# EAGLE schematic AutoSpielSimplified (EAGLE 9.2.0)
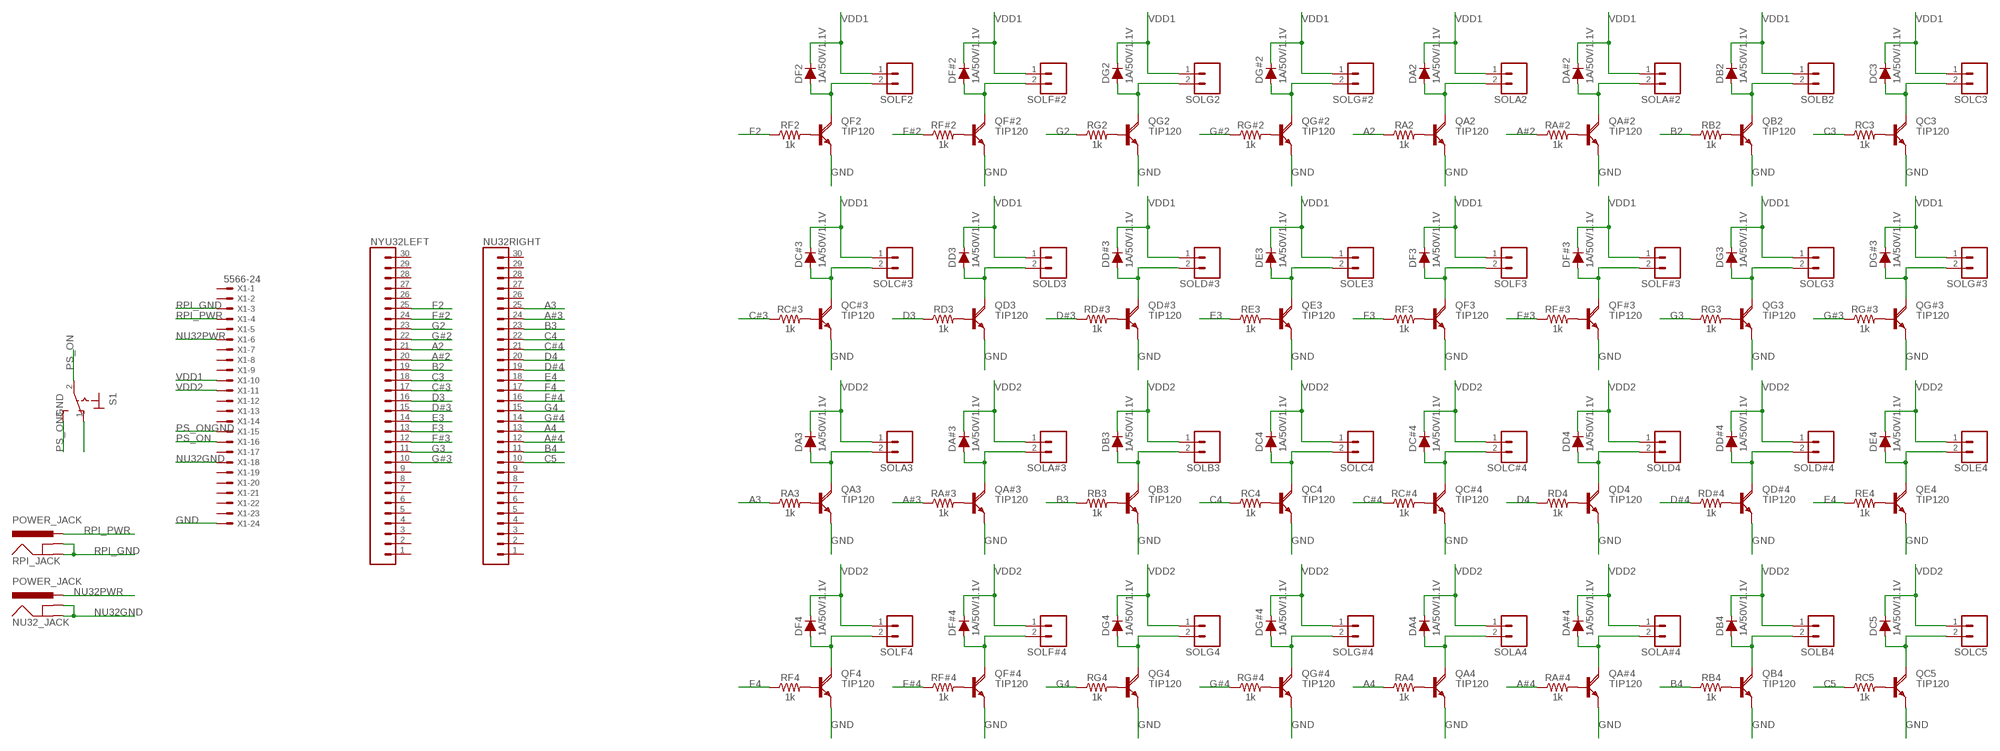
[diagram p0: schematic, sheet 1]

## Parts
DA2  1A/50V/1.1V  DIODE-PTH  [DIODE-1N4001]
DA3  1A/50V/1.1V  DIODE-PTH  [DIODE-1N4001]
DA4  1A/50V/1.1V  DIODE-PTH  [DIODE-1N4001]
DA#2  1A/50V/1.1V  DIODE-PTH  [DIODE-1N4001]
DA#3  1A/50V/1.1V  DIODE-PTH  [DIODE-1N4001]
DA#4  1A/50V/1.1V  DIODE-PTH  [DIODE-1N4001]
DB2  1A/50V/1.1V  DIODE-PTH  [DIODE-1N4001]
DB3  1A/50V/1.1V  DIODE-PTH  [DIODE-1N4001]
DB4  1A/50V/1.1V  DIODE-PTH  [DIODE-1N4001]
DC3  1A/50V/1.1V  DIODE-PTH  [DIODE-1N4001]
DC4  1A/50V/1.1V  DIODE-PTH  [DIODE-1N4001]
DC5  1A/50V/1.1V  DIODE-PTH  [DIODE-1N4001]
DC#3  1A/50V/1.1V  DIODE-PTH  [DIODE-1N4001]
DC#4  1A/50V/1.1V  DIODE-PTH  [DIODE-1N4001]
DD3  1A/50V/1.1V  DIODE-PTH  [DIODE-1N4001]
DD4  1A/50V/1.1V  DIODE-PTH  [DIODE-1N4001]
DD#3  1A/50V/1.1V  DIODE-PTH  [DIODE-1N4001]
DD#4  1A/50V/1.1V  DIODE-PTH  [DIODE-1N4001]
DE3  1A/50V/1.1V  DIODE-PTH  [DIODE-1N4001]
DE4  1A/50V/1.1V  DIODE-PTH  [DIODE-1N4001]
DF2  1A/50V/1.1V  DIODE-PTH  [DIODE-1N4001]
DF3  1A/50V/1.1V  DIODE-PTH  [DIODE-1N4001]
DF4  1A/50V/1.1V  DIODE-PTH  [DIODE-1N4001]
DF#2  1A/50V/1.1V  DIODE-PTH  [DIODE-1N4001]
DF#3  1A/50V/1.1V  DIODE-PTH  [DIODE-1N4001]
DF#4  1A/50V/1.1V  DIODE-PTH  [DIODE-1N4001]
DG2  1A/50V/1.1V  DIODE-PTH  [DIODE-1N4001]
DG3  1A/50V/1.1V  DIODE-PTH  [DIODE-1N4001]
DG4  1A/50V/1.1V  DIODE-PTH  [DIODE-1N4001]
DG#2  1A/50V/1.1V  DIODE-PTH  [DIODE-1N4001]
DG#3  1A/50V/1.1V  DIODE-PTH  [DIODE-1N4001]
DG#4  1A/50V/1.1V  DIODE-PTH  [DIODE-1N4001]
NU32_JACK  POWER_JACK  [POWER_JACK_PTH]
NU32RIGHT  CONN_30  [1X30]
NYU32LEFT  CONN_30  [1X30]
QA2  TIP120  [TO220AH]
QA3  TIP120  [TO220AH]
QA4  TIP120  [TO220AH]
QA#2  TIP120  [TO220AH]
QA#3  TIP120  [TO220AH]
QA#4  TIP120  [TO220AH]
QB2  TIP120  [TO220AH]
QB3  TIP120  [TO220AH]
QB4  TIP120  [TO220AH]
QC3  TIP120  [TO220AH]
QC4  TIP120  [TO220AH]
QC5  TIP120  [TO220AH]
QC#3  TIP120  [TO220AH]
QC#4  TIP120  [TO220AH]
QD3  TIP120  [TO220AH]
QD4  TIP120  [TO220AH]
QD#3  TIP120  [TO220AH]
QD#4  TIP120  [TO220AH]
QE3  TIP120  [TO220AH]
QE4  TIP120  [TO220AH]
QF2  TIP120  [TO220AH]
QF3  TIP120  [TO220AH]
QF4  TIP120  [TO220AH]
QF#2  TIP120  [TO220AH]
QF#3  TIP120  [TO220AH]
QF#4  TIP120  [TO220AH]
QG2  TIP120  [TO220AH]
QG3  TIP120  [TO220AH]
QG4  TIP120  [TO220AH]
QG#2  TIP120  [TO220AH]
QG#3  TIP120  [TO220AH]
QG#4  TIP120  [TO220AH]
RA2  1k  1KOHM-HORIZ-1/4W-5%  [AXIAL-0.3]
RA3  1k  1KOHM-HORIZ-1/4W-5%  [AXIAL-0.3]
RA4  1k  1KOHM-HORIZ-1/4W-5%  [AXIAL-0.3]
RA#2  1k  1KOHM-HORIZ-1/4W-5%  [AXIAL-0.3]
RA#3  1k  1KOHM-HORIZ-1/4W-5%  [AXIAL-0.3]
RA#4  1k  1KOHM-HORIZ-1/4W-5%  [AXIAL-0.3]
RB2  1k  1KOHM-HORIZ-1/4W-5%  [AXIAL-0.3]
RB3  1k  1KOHM-HORIZ-1/4W-5%  [AXIAL-0.3]
RB4  1k  1KOHM-HORIZ-1/4W-5%  [AXIAL-0.3]
RC3  1k  1KOHM-HORIZ-1/4W-5%  [AXIAL-0.3]
RC4  1k  1KOHM-HORIZ-1/4W-5%  [AXIAL-0.3]
RC5  1k  1KOHM-HORIZ-1/4W-5%  [AXIAL-0.3]
RC#3  1k  1KOHM-HORIZ-1/4W-5%  [AXIAL-0.3]
RC#4  1k  1KOHM-HORIZ-1/4W-5%  [AXIAL-0.3]
RD3  1k  1KOHM-HORIZ-1/4W-5%  [AXIAL-0.3]
RD4  1k  1KOHM-HORIZ-1/4W-5%  [AXIAL-0.3]
RD#3  1k  1KOHM-HORIZ-1/4W-5%  [AXIAL-0.3]
RD#4  1k  1KOHM-HORIZ-1/4W-5%  [AXIAL-0.3]
RE3  1k  1KOHM-HORIZ-1/4W-5%  [AXIAL-0.3]
RE4  1k  1KOHM-HORIZ-1/4W-5%  [AXIAL-0.3]
RF2  1k  1KOHM-HORIZ-1/4W-5%  [AXIAL-0.3]
RF3  1k  1KOHM-HORIZ-1/4W-5%  [AXIAL-0.3]
RF4  1k  1KOHM-HORIZ-1/4W-5%  [AXIAL-0.3]
RF#2  1k  1KOHM-HORIZ-1/4W-5%  [AXIAL-0.3]
RF#3  1k  1KOHM-HORIZ-1/4W-5%  [AXIAL-0.3]
RF#4  1k  1KOHM-HORIZ-1/4W-5%  [AXIAL-0.3]
RG2  1k  1KOHM-HORIZ-1/4W-5%  [AXIAL-0.3]
RG3  1k  1KOHM-HORIZ-1/4W-5%  [AXIAL-0.3]
RG4  1k  1KOHM-HORIZ-1/4W-5%  [AXIAL-0.3]
RG#2  1k  1KOHM-HORIZ-1/4W-5%  [AXIAL-0.3]
RG#3  1k  1KOHM-HORIZ-1/4W-5%  [AXIAL-0.3]
RG#4  1k  1KOHM-HORIZ-1/4W-5%  [AXIAL-0.3]
RPI_JACK  POWER_JACK  [POWER_JACK_PTH]
S1  M9040P  [M9040P]
SOLA2  CONN_02PTH4  [1X02_XTRA_BIG]
SOLA3  CONN_02PTH4  [1X02_XTRA_BIG]
SOLA4  CONN_02PTH4  [1X02_XTRA_BIG]
SOLA#2  CONN_02PTH4  [1X02_XTRA_BIG]
SOLA#3  CONN_02PTH4  [1X02_XTRA_BIG]
SOLA#4  CONN_02PTH4  [1X02_XTRA_BIG]
SOLB2  CONN_02PTH4  [1X02_XTRA_BIG]
SOLB3  CONN_02PTH4  [1X02_XTRA_BIG]
SOLB4  CONN_02PTH4  [1X02_XTRA_BIG]
SOLC3  CONN_02PTH4  [1X02_XTRA_BIG]
SOLC4  CONN_02PTH4  [1X02_XTRA_BIG]
SOLC5  CONN_02PTH4  [1X02_XTRA_BIG]
SOLC#3  CONN_02PTH4  [1X02_XTRA_BIG]
SOLC#4  CONN_02PTH4  [1X02_XTRA_BIG]
SOLD3  CONN_02PTH4  [1X02_XTRA_BIG]
SOLD4  CONN_02PTH4  [1X02_XTRA_BIG]
SOLD#3  CONN_02PTH4  [1X02_XTRA_BIG]
SOLD#4  CONN_02PTH4  [1X02_XTRA_BIG]
SOLE3  CONN_02PTH4  [1X02_XTRA_BIG]
SOLE4  CONN_02PTH4  [1X02_XTRA_BIG]
SOLF2  CONN_02PTH4  [1X02_XTRA_BIG]
SOLF3  CONN_02PTH4  [1X02_XTRA_BIG]
SOLF4  CONN_02PTH4  [1X02_XTRA_BIG]
SOLF#2  CONN_02PTH4  [1X02_XTRA_BIG]
SOLF#3  CONN_02PTH4  [1X02_XTRA_BIG]
SOLF#4  CONN_02PTH4  [1X02_XTRA_BIG]
SOLG2  CONN_02PTH4  [1X02_XTRA_BIG]
SOLG3  CONN_02PTH4  [1X02_XTRA_BIG]
SOLG4  CONN_02PTH4  [1X02_XTRA_BIG]
SOLG#2  CONN_02PTH4  [1X02_XTRA_BIG]
SOLG#3  CONN_02PTH4  [1X02_XTRA_BIG]
SOLG#4  CONN_02PTH4  [1X02_XTRA_BIG]
X1  5566-24  [5566-24]

## Nets
A2: NYU32LEFT.21 RA2.P$1
A3: NU32RIGHT.25 RA3.P$1
A4: NU32RIGHT.13 RA4.P$1
A#2: NYU32LEFT.20 RA#2.P$1
A#3: NU32RIGHT.24 RA#3.P$1
A#4: NU32RIGHT.12 RA#4.P$1
B2: NYU32LEFT.19 RB2.P$1
B3: NU32RIGHT.23 RB3.P$1
B4: NU32RIGHT.11 RB4.P$1
C3: NYU32LEFT.18 RC3.P$1
C4: NU32RIGHT.22 RC4.P$1
C5: NU32RIGHT.10 RC5.P$1
C#3: NYU32LEFT.17 RC#3.P$1
C#4: NU32RIGHT.21 RC#4.P$1
D3: NYU32LEFT.16 RD3.P$1
D4: NU32RIGHT.20 RD4.P$1
D#3: NYU32LEFT.15 RD#3.P$1
D#4: NU32RIGHT.19 RD#4.P$1
E3: NYU32LEFT.14 RE3.P$1
E4: NU32RIGHT.18 RE4.P$1
F2: NYU32LEFT.25 RF2.P$1
F3: NYU32LEFT.13 RF3.P$1
F4: NU32RIGHT.17 RF4.P$1
F#2: NYU32LEFT.24 RF#2.P$1
F#3: NYU32LEFT.12 RF#3.P$1
F#4: NU32RIGHT.16 RF#4.P$1
G2: NYU32LEFT.23 RG2.P$1
G3: NYU32LEFT.11 RG3.P$1
G4: NU32RIGHT.15 RG4.P$1
G#2: NYU32LEFT.22 RG#2.P$1
G#3: NYU32LEFT.10 RG#3.P$1
G#4: NU32RIGHT.14 RG#4.P$1
GND: QA2.E QA3.E QA4.E QA#2.E QA#3.E QA#4.E QB2.E QB3.E QB4.E QC3.E QC4.E QC5.E QC#3.E QC#4.E QD3.E QD4.E QD#3.E QD#4.E QE3.E QE4.E QF2.E QF3.E QF4.E QF#2.E QF#3.E QF#4.E QG2.E QG3.E QG4.E QG#2.E QG#3.E QG#4.E X1.24
N$1: QF2.B RF2.P$2
N$2: QC#3.B RC#3.P$2
N$3: DF2.A QF2.C SOLF2.2
N$4: QF#2.B RF#2.P$2
N$5: DF#2.A QF#2.C SOLF#2.2
N$6: DC#3.A QC#3.C SOLC#3.2
N$7: QG2.B RG2.P$2
N$8: DG2.A QG2.C SOLG2.2
N$9: QD3.B RD3.P$2
N$10: QG#2.B RG#2.P$2
N$11: DG#2.A QG#2.C SOLG#2.2
N$12: DD3.A QD3.C SOLD3.2
N$13: QA2.B RA2.P$2
N$14: DA2.A QA2.C SOLA2.2
N$15: QD#3.B RD#3.P$2
N$16: QA#2.B RA#2.P$2
N$17: DA#2.A QA#2.C SOLA#2.2
N$18: DD#3.A QD#3.C SOLD#3.2
N$19: QB2.B RB2.P$2
N$20: DB2.A QB2.C SOLB2.2
N$21: QE3.B RE3.P$2
N$22: QC3.B RC3.P$2
N$23: DC3.A QC3.C SOLC3.2
N$24: DE3.A QE3.C SOLE3.2
N$25: QA3.B RA3.P$2
N$26: DA3.A QA3.C SOLA3.2
N$27: QF3.B RF3.P$2
N$28: DF3.A QF3.C SOLF3.2
N$29: QF#3.B RF#3.P$2
N$30: DF#3.A QF#3.C SOLF#3.2
N$31: QG3.B RG3.P$2
N$32: DG3.A QG3.C SOLG3.2
N$33: QG#3.B RG#3.P$2
N$34: DG#3.A QG#3.C SOLG#3.2
N$35: QF4.B RF4.P$2
N$36: DF4.A QF4.C SOLF4.2
N$37: QF#4.B RF#4.P$2
N$38: DF#4.A QF#4.C SOLF#4.2
N$39: QG4.B RG4.P$2
N$40: DG4.A QG4.C SOLG4.2
N$41: QG#4.B RG#4.P$2
N$42: DG#4.A QG#4.C SOLG#4.2
N$43: QA4.B RA4.P$2
N$44: DA4.A QA4.C SOLA4.2
N$45: QA#4.B RA#4.P$2
N$46: DA#4.A QA#4.C SOLA#4.2
N$47: QB4.B RB4.P$2
N$48: DB4.A QB4.C SOLB4.2
N$49: QC5.B RC5.P$2
N$50: DC5.A QC5.C SOLC5.2
N$52: QA#3.B RA#3.P$2
N$53: DA#3.A QA#3.C SOLA#3.2
N$55: QB3.B RB3.P$2
N$56: DB3.A QB3.C SOLB3.2
N$57: S1.1(O)
N$58: QC4.B RC4.P$2
N$59: DC4.A QC4.C SOLC4.2
N$61: QC#4.B RC#4.P$2
N$62: DC#4.A QC#4.C SOLC#4.2
N$64: QD4.B RD4.P$2
N$65: DD4.A QD4.C SOLD4.2
N$67: QD#4.B RD#4.P$2
N$68: DD#4.A QD#4.C SOLD#4.2
N$70: QE4.B RE4.P$2
N$71: DE4.A QE4.C SOLE4.2
NU32GND: NU32_JACK.GND NU32_JACK.GNDBREAK X1.18
NU32PWR: NU32_JACK.PWR X1.6
PS_ON: S1.2(P) X1.16
PS_ONGND: S1.3(S) X1.15
RPI_GND: RPI_JACK.GND RPI_JACK.GNDBREAK X1.3
RPI_PWR: RPI_JACK.PWR X1.4
VDD1: DA2.C DA#2.C DB2.C DC3.C DC#3.C DD3.C DD#3.C DE3.C DF2.C DF3.C DF#2.C DF#3.C DG2.C DG3.C DG#2.C DG#3.C SOLA2.1 SOLA#2.1 SOLB2.1 SOLC3.1 SOLC#3.1 SOLD3.1 SOLD#3.1 SOLE3.1 SOLF2.1 SOLF3.1 SOLF#2.1 SOLF#3.1 SOLG2.1 SOLG3.1 SOLG#2.1 SOLG#3.1 X1.10
VDD2: DA3.C DA4.C DA#3.C DA#4.C DB3.C DB4.C DC4.C DC5.C DC#4.C DD4.C DD#4.C DE4.C DF4.C DF#4.C DG4.C DG#4.C SOLA3.1 SOLA4.1 SOLA#3.1 SOLA#4.1 SOLB3.1 SOLB4.1 SOLC4.1 SOLC5.1 SOLC#4.1 SOLD4.1 SOLD#4.1 SOLE4.1 SOLF4.1 SOLF#4.1 SOLG4.1 SOLG#4.1 X1.11
Unconnected: NU32RIGHT.1 NU32RIGHT.2 NU32RIGHT.3 NU32RIGHT.4 NU32RIGHT.5 NU32RIGHT.6 NU32RIGHT.7 NU32RIGHT.8 NU32RIGHT.9 NU32RIGHT.26 NU32RIGHT.27 NU32RIGHT.28 NU32RIGHT.29 NU32RIGHT.30 NYU32LEFT.1 NYU32LEFT.2 NYU32LEFT.3 NYU32LEFT.4 NYU32LEFT.5 NYU32LEFT.6 NYU32LEFT.7 NYU32LEFT.8 NYU32LEFT.9 NYU32LEFT.26 NYU32LEFT.27 NYU32LEFT.28 NYU32LEFT.29 NYU32LEFT.30 X1.1 X1.2 X1.5 X1.7 X1.8 X1.9 X1.12 X1.13 X1.14 X1.17 X1.19 X1.20 X1.21 X1.22 X1.23

## Library data of the parts
DA2-DA4 DA#2-DA#4 DB2-DB4 DC3-DC5 DC#3 DC#4 DD3 DD4 DD#3 DD#4 DE3 DE4 DF2-DF4 DF#2-DF#4 DG2-DG4 DG#2-DG#4 = SparkFun-DiscreteSemi:DIODE: Diode These are standard reverse protection diodes and small signal diodes. SparkFun Products: SparkFun SparkPunk Sound Kit <https://www.sparkfun.com/products/11177> SparkFun ESP8266 Thing <https://www.sparkfun.com/products/13231>; PROD_ID: DIO-09176
NU32_JACK RPI_JACK = SparkFun-Connectors:POWER_JACK: Power Jack Connector This is the standard 5.5mm barrel jack for power. The PTH is the most common, proven, reliable, footprint. The Slot footprint only works if the mill layer is transmitted to the PCB fab house so be warned. Here are the connectors we sell at SparkFun: DC Barrel Power Jack/Connector <https://www.sparkfun.com/products/119> (PRT-00119) DC Barrel Power Jack/Connector (SMD) <https://www.sparkfun.com/products/12748> (PRT-12748) DC Barrel Jack Adapter - Breadboard Compatible <https://www.sparkfun.com/products/10811> (PRT-10811) It is used on this SparkFun product (and many, many others): SparkFun RedBoard - Programmed with Arduino <https://www.sparkfun.com/products/12757> (DEV-12757) Also, if you need a mating power supply or connector, please check these out: Wall Adapter Power Supply - 9VDC 650mA <https://www.sparkfun.com/products/298> (TOL-00298) DC Barrel Jack Adapter - Male <https://www.sparkfun.com/products/10287> (PRT-10287); PROD_ID: CONN-08197
NU32RIGHT NYU32LEFT = SparkFun-Connectors:CONN_30: Multi connection point. Often used as Generic Header-pin footprint for 0.1 inch spaced/style header connections On any of the 0.1 inch spaced packages, you can populate with these: Break Away Headers - Straight <https://www.sparkfun.com/products/116> (PRT-00116) Break Away Male Headers - Right Angle <https://www.sparkfun.com/products/553> (PRT-00553) Female Headers <https://www.sparkfun.com/products/115> (PRT-00115) Break Away Headers - Machine Pin <https://www.sparkfun.com/products/117> (PRT-00117) Break Away Female Headers - Swiss Machine Pin <https://www.sparkfun.com/products/743> (PRT-00743) For SCREWTERMINALS and SPRING TERMINALS visit here: Screw Terimnals on SparkFun.com <https://www.sparkfun.com/search/results?term=Screw+Terminals> (5mm/3.5mm/2.54mm spacing) This device is also useful as a general connection point to wire up your design to another part of your project. Our various solder wires solder well into these plated through hole pads. Hook-Up Wire - Assortment (Stranded, 22 AWG) <https://www.sparkfun.com/products/11375> (PRT-11375) Hook-Up Wire - Assortment (Solid Core, 22 AWG) <https://www.sparkfun.com/products/11367> (PRT-11367) View the entire wire category on our website here <https://www.sparkfun.com/categories/141> Special notes: Molex polarized connector foot print use with SKU : PRT-08231 with associated crimp pins and housings. 1MM SMD Version SKU: PRT-10208 NOTES ON THE VARIANTS LOCK and LOCK_LONGPADS... This footprint was designed to help hold the alignment of a through-hole component (i.e. 6-pin header) while soldering it into place. You may notice that each hole has been shifted either up or down by 0.005 of an inch from it's more standard position (which is a perfectly straight line). This slight alteration caused the pins (the squares in the middle) to touch the edges of the holes. Because they are alternating, it causes a "brace" to hold the component in place. 0.005 has proven to be the perfect amount of "off-center" position when using our standard breakaway headers. Although looks a little odd when you look at the bare footprint, once you have a header in there, the alteration is very hard to notice. Also,if you push a header all the way into place, it is covered up entirely on the bottom side.
QA2-QA4 QA#2-QA#4 QB2-QB4 QC3-QC5 QC#3 QC#4 QD3 QD4 QD#3 QD#4 QE3 QE4 QF2-QF4 QF#2-QF#4 QG2-QG4 QG#2-QG#4 = transistor-power:TIP120: NPN DARLINGTON TRANSISTOR
RA2-RA4 RA#2-RA#4 RB2-RB4 RC3-RC5 RC#3 RC#4 RD3 RD4 RD#3 RD#4 RE3 RE4 RF2-RF4 RF#2-RF#4 RG2-RG4 RG#2-RG#4 = SparkFun-Resistors:1KOHM: 1kΩ resistor A resistor is a passive two-terminal electrical component that implements electrical resistance as a circuit element. Resistors act to reduce current flow, and, at the same time, act to lower voltage levels within circuits. - Wikipedia; PROD_ID: RES-08380
S1 = switch:M9040P: TOGGLE SWITCH Marquardt
SOLA2-SOLA4 SOLA#2-SOLA#4 SOLB2-SOLB4 SOLC3-SOLC5 SOLC#3 SOLC#4 SOLD3 SOLD4 SOLD#3 SOLD#4 SOLE3 SOLE4 SOLF2-SOLF4 SOLF#2-SOLF#4 SOLG2-SOLG4 SOLG#2-SOLG#4 = SparkFun-Connectors:CONN_02: Multi connection point. Often used as Generic Header-pin footprint for 0.1 inch spaced/style header connections On any of the 0.1 inch spaced packages, you can populate with these: Break Away Headers - Straight <https://www.sparkfun.com/products/116> (PRT-00116) Break Away Male Headers - Right Angle <https://www.sparkfun.com/products/553> (PRT-00553) Female Headers <https://www.sparkfun.com/products/115> (PRT-00115) Break Away Headers - Machine Pin <https://www.sparkfun.com/products/117> (PRT-00117) Break Away Female Headers - Swiss Machine Pin <https://www.sparkfun.com/products/743> (PRT-00743) For SCREWTERMINALS and SPRING TERMINALS visit here: Screw Terimnals on SparkFun.com <https://www.sparkfun.com/search/results?term=Screw+Terminals> (5mm/3.5mm/2.54mm spacing) This device is also useful as a general connection point to wire up your design to another part of your project. Our various solder wires solder well into these plated through hole pads. Hook-Up Wire - Assortment (Stranded, 22 AWG) <https://www.sparkfun.com/products/11375> (PRT-11375) Hook-Up Wire - Assortment (Solid Core, 22 AWG) <https://www.sparkfun.com/products/11367> (PRT-11367) View the entire wire category on our website here <https://www.sparkfun.com/categories/141> Special notes: Molex polarized connector foot print use with: PRT-08233 with associated crimp pins and housings. 2.54_SCREWTERM for use with PRT-10571. 3.5mm Screw Terminal footprints for PRT-08084 5mm Screw Terminal footprints for use with PRT-08432
X1 = con-molex:5566-24: Mini FIT connector 24 pol Source: http://www.molex.com; MF: MOLEX; OC_FARNELL: unknown; OC_NEWARK: unknown